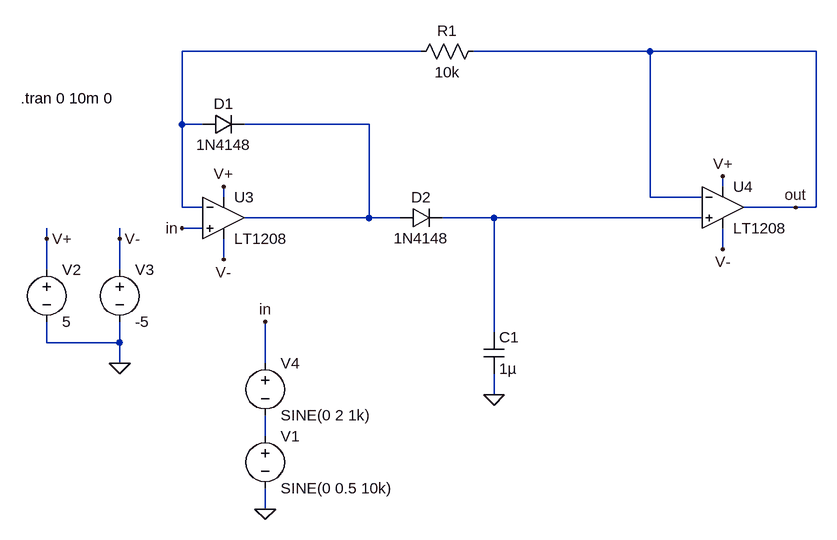
[diagram p0: schematic ETAJ 4.asc]
ETAJ 4.asc, the LTspice schematic file:
Version 4
SHEET 1 1224 880
WIRE 240 -288 -128 -288
WIRE 592 -288 320 -288
WIRE 848 -288 592 -288
WIRE -128 -176 -128 -288
WIRE -96 -176 -128 -176
WIRE 160 -176 -32 -176
WIRE 704 -80 704 -96
WIRE -64 -64 -64 -80
WIRE 592 -64 592 -288
WIRE 672 -64 592 -64
WIRE -128 -48 -128 -176
WIRE -96 -48 -128 -48
WIRE 816 -48 736 -48
WIRE 848 -48 848 -288
WIRE 848 -48 816 -48
WIRE 160 -32 160 -176
WIRE 160 -32 -32 -32
WIRE 208 -32 160 -32
WIRE 352 -32 272 -32
WIRE 672 -32 352 -32
WIRE -96 -16 -128 -16
WIRE -336 0 -336 -16
WIRE -224 0 -224 -16
WIRE 704 16 704 -16
WIRE -64 32 -64 0
WIRE -336 48 -336 0
WIRE -224 48 -224 0
WIRE 352 144 352 -32
WIRE -336 160 -336 128
WIRE -224 160 -224 128
WIRE -224 160 -336 160
WIRE -224 192 -224 160
WIRE 0 192 0 128
WIRE 352 240 352 208
WIRE 0 304 0 272
WIRE 0 416 0 384
FLAG 0 416 0
FLAG -224 192 0
FLAG -336 0 V+
FLAG -224 0 V-
FLAG -64 -80 V+
FLAG -64 32 V-
FLAG 704 -96 V+
FLAG 704 16 V-
FLAG 352 240 0
FLAG 0 128 in
FLAG -128 -16 in
FLAG 816 -48 out
SYMBOL voltage 0 288 R0
WINDOW 123 0 0 Left 2
WINDOW 39 0 0 Left 2
SYMATTR InstName V1
SYMATTR Value SINE(0 0.5 10k)
SYMBOL voltage -336 32 R0
WINDOW 123 0 0 Left 2
WINDOW 39 0 0 Left 2
SYMATTR InstName V2
SYMATTR Value 5
SYMBOL voltage -224 32 R0
WINDOW 123 0 0 Left 2
WINDOW 39 0 0 Left 2
SYMATTR InstName V3
SYMATTR Value -5
SYMBOL diode -96 -160 R270
WINDOW 0 32 32 VTop 2
WINDOW 3 0 32 VBottom 2
SYMATTR InstName D1
SYMATTR Value 1N4148
SYMBOL diode 208 -16 R270
WINDOW 0 32 32 VTop 2
WINDOW 3 0 32 VBottom 2
SYMATTR InstName D2
SYMATTR Value 1N4148
SYMBOL res 336 -304 R90
WINDOW 0 0 56 VBottom 2
WINDOW 3 32 56 VTop 2
SYMATTR InstName R1
SYMATTR Value 10k
SYMBOL cap 336 144 R0
SYMATTR InstName C1
SYMATTR Value 1µ
SYMBOL voltage 0 176 R0
WINDOW 123 0 0 Left 2
WINDOW 39 0 0 Left 2
SYMATTR InstName V4
SYMATTR Value SINE(0 2 1k)
SYMBOL OpAmps\\LT1208 -64 -96 R0
SYMATTR InstName U3
SYMBOL OpAmps\\LT1208 704 -112 R0
SYMATTR InstName U4
TEXT -376 -216 Left 2 !.tran 0 10m 0

The netlist it stands for:
* ETAJ 4.asc
V1 N004 0 SINE(0 0.5 10k)
V2 V+ 0 5
V3 V- 0 -5
D1 N001 N002 1N4148
D2 N002 N003 1N4148
R1 out N001 10k
C1 N003 0 1µ
V4 in N004 SINE(0 2 1k)
XU3 in N001 V+ V- N002 LT1208  ; pins In+ In- V+ V- OUT
XU4 N003 out V+ V- out LT1208  ; pins In+ In- V+ V- OUT
.model D D
.lib standard.dio
.tran 0 10m 0
.backanno
.end